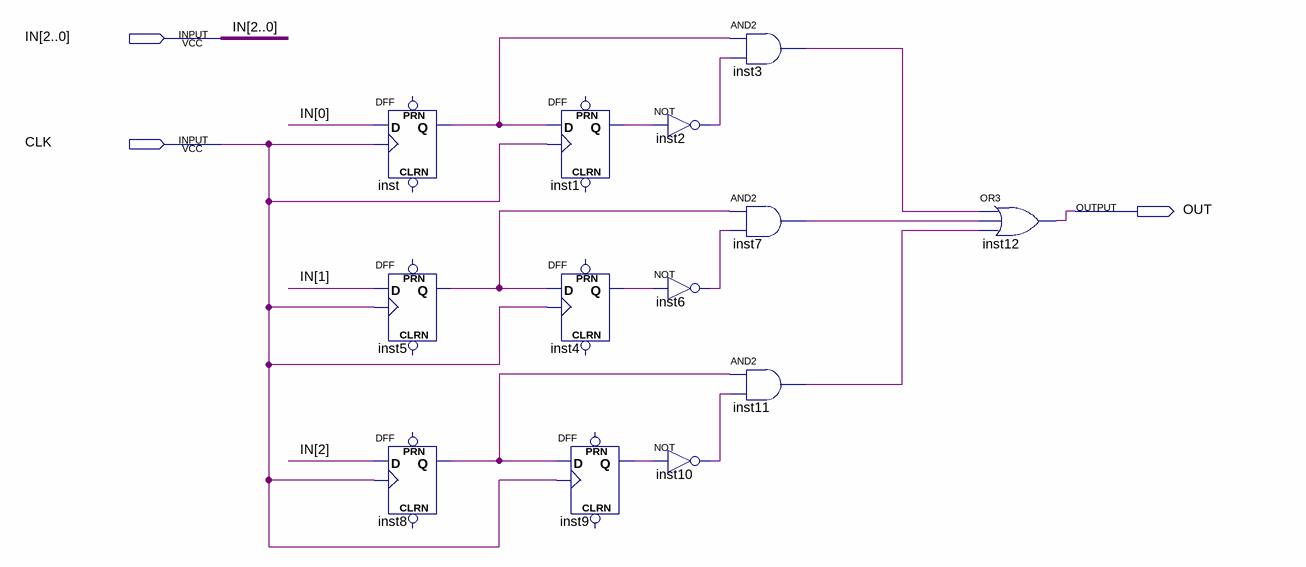
[diagram p0: schematic sheet]
// Quartus schematic rising_edge_detector.bdf as structural Verilog: 13 symbols, 3 pins
module rising_edge_detector (
  input  [2:0] IN,
  input  CLK,
  output OUT
);

  wire inst1_q, inst2_out, inst3_out, inst4_q, inst5_q, inst6_out, inst7_out, inst8_q, inst9_q, inst10_out,
       inst11_out, inst_q;

  DFF inst (.CLK(CLK), .D(IN[0]), .Q(inst_q));  // open: CLRN, PRN
  DFF inst5 (.CLK(CLK), .D(IN[1]), .Q(inst5_q));  // open: CLRN, PRN
  DFF inst8 (.CLK(CLK), .D(IN[2]), .Q(inst8_q));  // open: CLRN, PRN
  DFF inst1 (.CLK(CLK), .D(inst_q), .Q(inst1_q));  // open: CLRN, PRN
  DFF inst4 (.CLK(CLK), .D(inst5_q), .Q(inst4_q));  // open: CLRN, PRN
  DFF inst9 (.CLK(CLK), .D(inst8_q), .Q(inst9_q));  // open: CLRN, PRN
  not inst2 (inst2_out, inst1_q);
  not inst6 (inst6_out, inst4_q);
  not inst10 (inst10_out, inst9_q);
  and inst3 (inst3_out, inst_q, inst2_out);
  and inst7 (inst7_out, inst5_q, inst6_out);
  and inst11 (inst11_out, inst8_q, inst10_out);
  or inst12 (OUT, inst3_out, inst7_out, inst11_out);
endmodule
